# Altium schematic sheet 31.SchDoc
size 513 x 386 mm
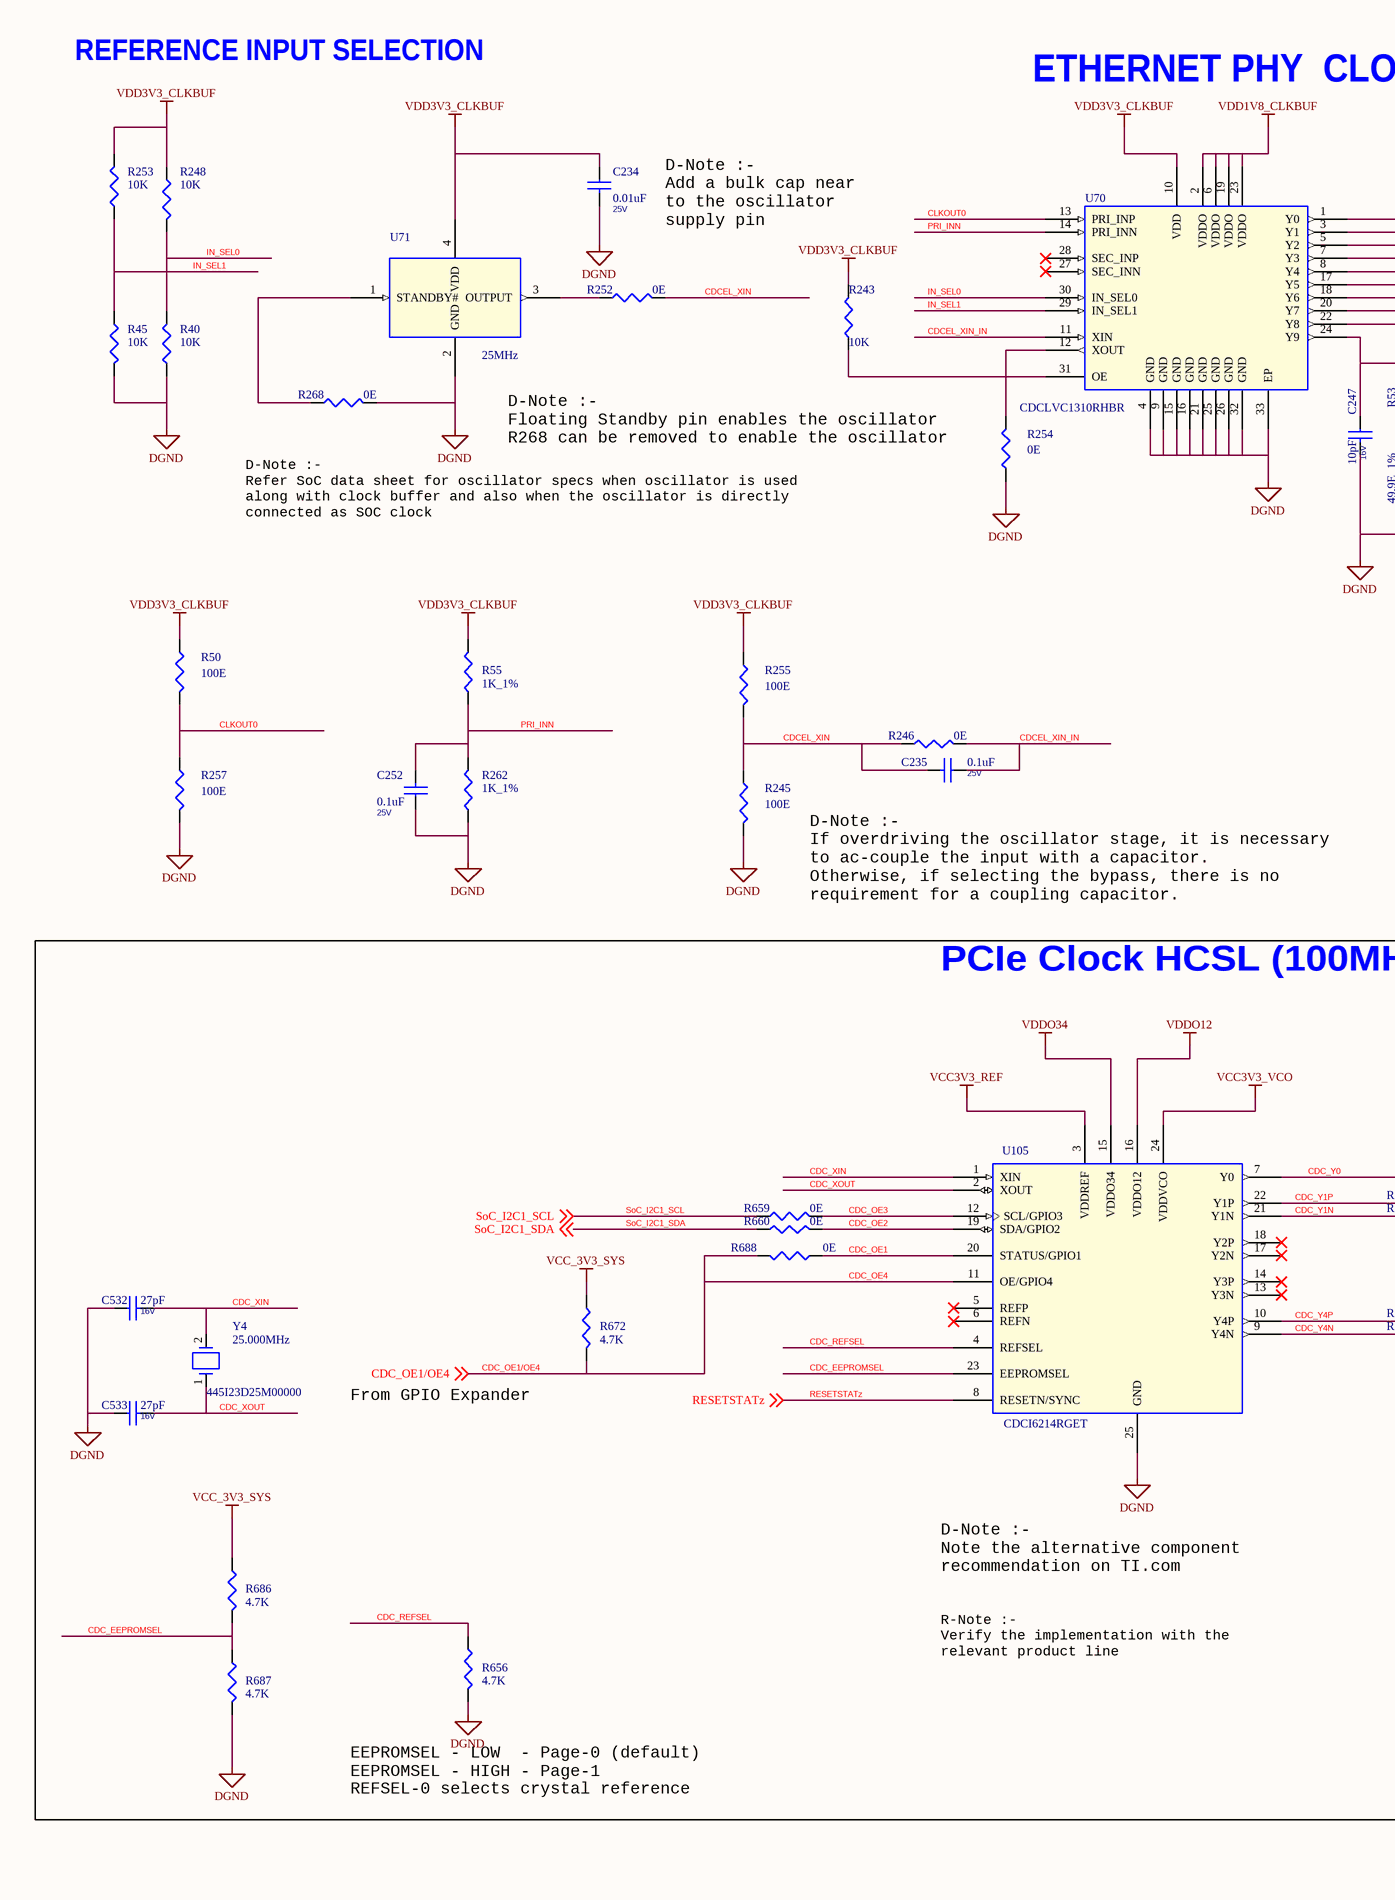
[diagram p0: 31.SchDoc, left]
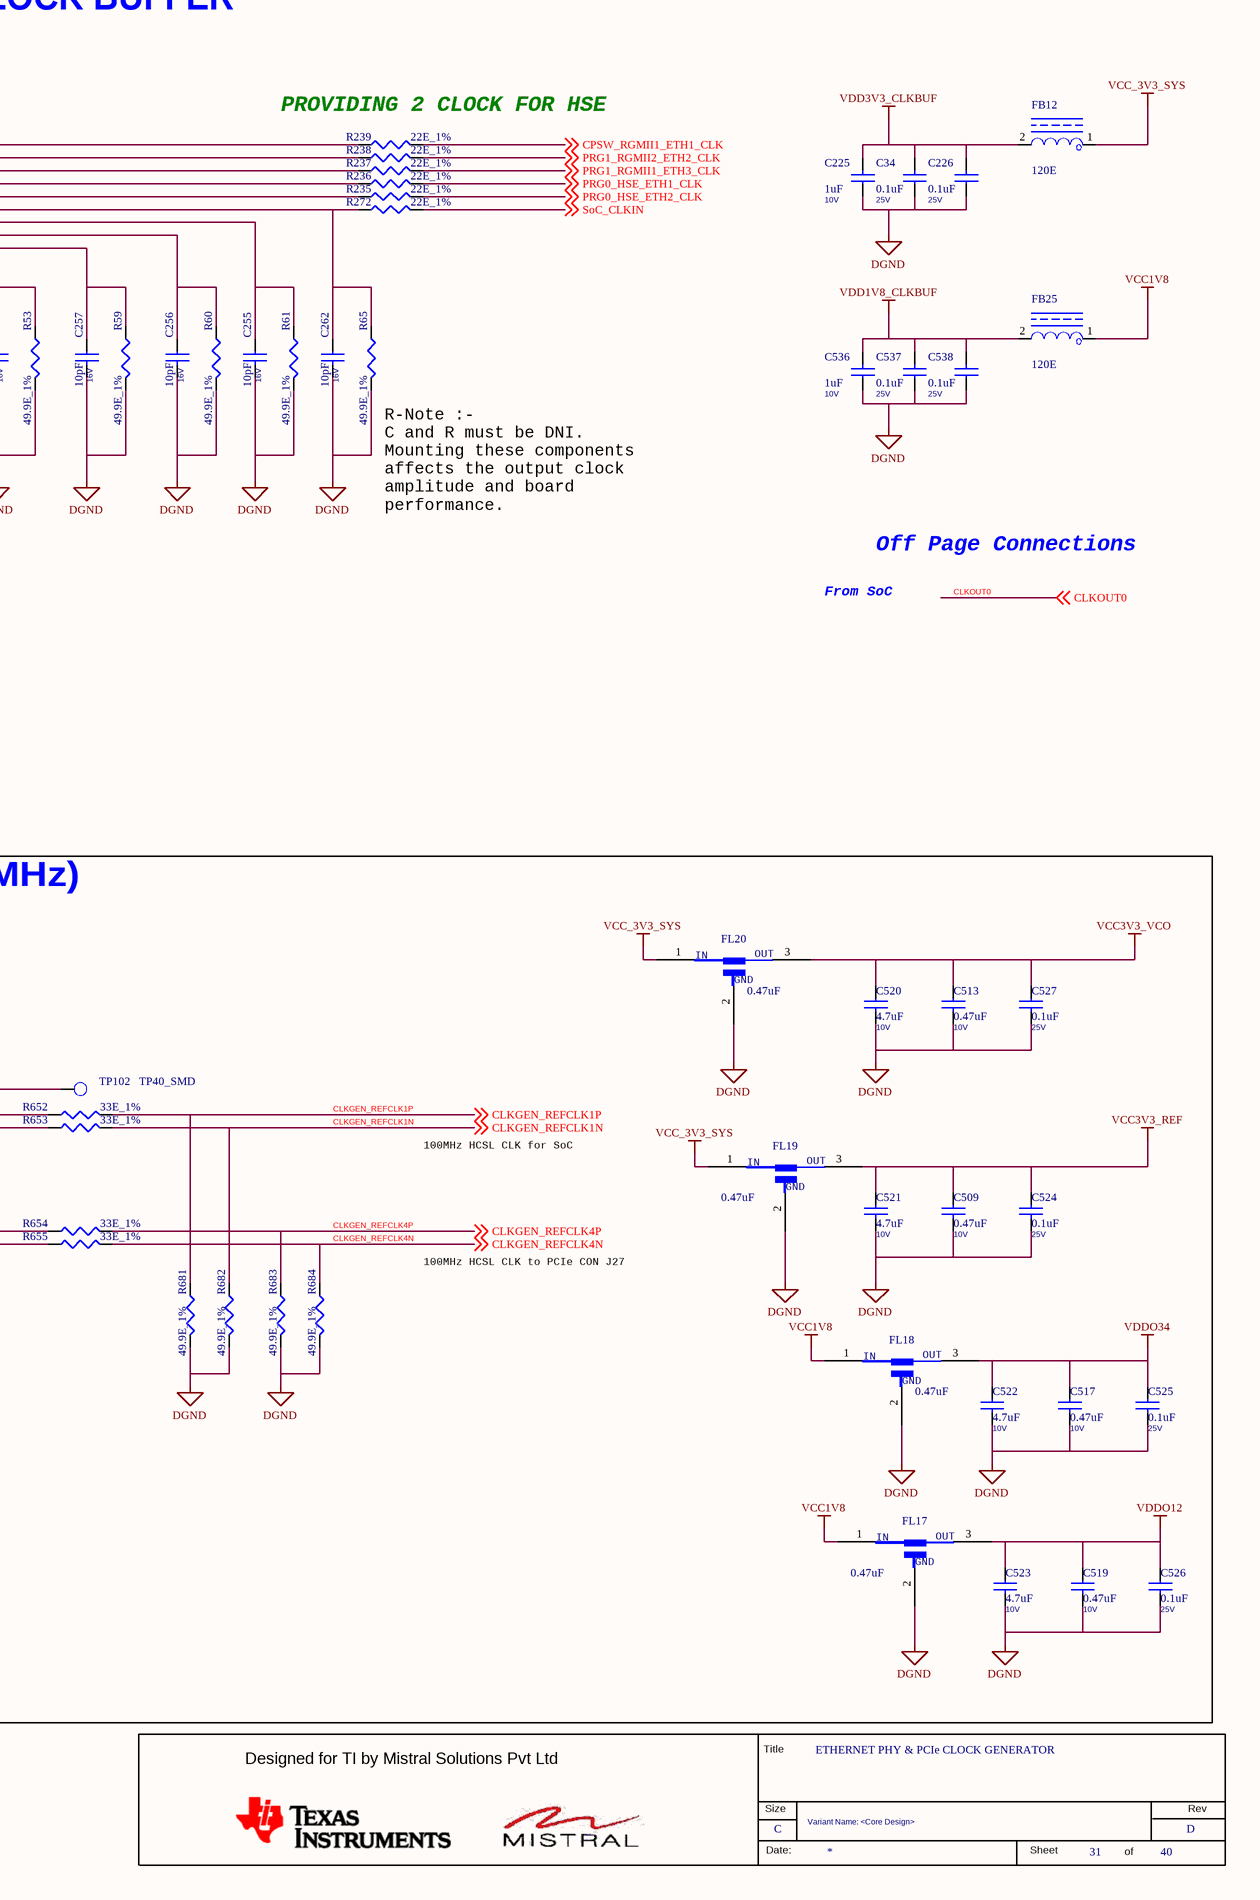
[diagram p1: 31.SchDoc, right]

## Parts
*  RevCode: D  Title: ETHERNET PHY & PCIe CLOCK GENERATOR  Page Size: C  Page Number: 31  Page Count: 40  Variant Name: <Core Design>  (hidden comment: MISTRAL_TITLEBLK_CSIZE)  (graphical)
C34  0.1uF  Voltage: 25V  [CAP0402_0-75]
C225  1uF  Voltage: 10V  [CAP0402_0-75]
C226  0.1uF  Voltage: 25V  [CAP0402_0-75]
C234  0.01uF  Voltage: 25V  [CAP0201_0-5]
C235  0.1uF  Voltage: 25V  [CAP0402_0-75]
C247  10pF  Voltage: 16V  [CAP0402_0-75]
C252  0.1uF  Voltage: 25V  [CAP0402_0-75]
C255  10pF  Voltage: 16V  [CAP0402_0-75]
C256  10pF  Voltage: 16V  [CAP0402_0-75]
C257  10pF  Voltage: 16V  [CAP0402_0-75]
C262  10pF  Voltage: 16V  [CAP0402_0-75]
C509  0.47uF  Voltage: 10V  [CAP0402_0-75]
C513  0.47uF  Voltage: 10V  [CAP0402_0-75]
C517  0.47uF  Voltage: 10V  [CAP0402_0-75]
C519  0.47uF  Voltage: 10V  [CAP0402_0-75]
C520  4.7uF  Voltage: 10V  [CAP0402_0-75]
C521  4.7uF  Voltage: 10V  [CAP0402_0-75]
C522  4.7uF  Voltage: 10V  [CAP0402_0-75]
C523  4.7uF  Voltage: 10V  [CAP0402_0-75]
C524  0.1uF  Voltage: 25V  [CAP0402_0-75]
C525  0.1uF  Voltage: 25V  [CAP0402_0-75]
C526  0.1uF  Voltage: 25V  [CAP0402_0-75]
C527  0.1uF  Voltage: 25V  [CAP0402_0-75]
C532  27pF  Voltage: 16V  [CAP0402_0-75]
C533  27pF  Voltage: 16V  [CAP0402_0-75]
C536  1uF  Voltage: 10V  [CAP0402_0-75]
C537  0.1uF  Voltage: 25V  [CAP0402_0-75]
C538  0.1uF  Voltage: 25V  [CAP0402_0-75]
FB12  120E  [IND0603_1]
FB25  120E  [IND0603_1]
FL17  0.47uF  [EMIFIL_NFM21P_0805]
FL18  0.47uF  [EMIFIL_NFM21P_0805]
FL19  0.47uF  [EMIFIL_NFM21P_0805]
FL20  0.47uF  [EMIFIL_NFM21P_0805]
R40  10K  [RES0402_0-5]
R45  10K  [RES0402_0-5]
R50  100E  [RES0402_0-5]
R53  49.9E_1%  [RES0402_0-5]
R55  1K_1%  [RES0402_0-5]
R59  49.9E_1%  [RES0402_0-5]
R60  49.9E_1%  [RES0402_0-5]
R61  49.9E_1%  [RES0402_0-5]
R65  49.9E_1%  [RES0402_0-5]
R235  22E_1%  [RES0402_0-5]
R236  22E_1%  [RES0402_0-5]
R237  22E_1%  [RES0402_0-5]
R238  22E_1%  [RES0402_0-5]
R239  22E_1%  [RES0402_0-5]
R243  10K  [RES0402_0-5]
R245  100E  [RES0402_0-5]
R246  0E  [RES0402_0-5]
R248  10K  [RES0402_0-5]
R252  0E  [RES0402_0-5]
R253  10K  [RES0402_0-5]
R254  0E  [RES0402_0-5]
R255  100E  [RES0402_0-5]
R257  100E  [RES0402_0-5]
R262  1K_1%  [RES0402_0-5]
R268  0E  [RES0402_0-5]
R272  22E_1%  [RES0402_0-5]
R652  33E_1%  [RES0402_0-5]
R653  33E_1%  [RES0402_0-5]
R654  33E_1%  [RES0402_0-5]
R655  33E_1%  [RES0402_0-5]
R656  4.7K  [RES0402_0-5]
R659  0E  [RES0402_0-5]
R660  0E  [RES0402_0-5]
R672  4.7K  [RES0402_0-5]
R681  49.9E_1%  [RES0402_0-5]
R682  49.9E_1%  [RES0402_0-5]
R683  49.9E_1%  [RES0402_0-5]
R684  49.9E_1%  [RES0402_0-5]
R686  4.7K  [RES0402_0-5]
R687  4.7K  [RES0402_0-5]
R688  0E  [RES0402_0-5]
TP102  TP40_SMD  [TP40_SMD]
U70  CDCLVC1310RHBR  [QFN32_19-68_200X200_1]
U71  25MHz  [OSC4_ASFLMB_200X130_SMD]
U105  CDCI6214RGET  [QFN24_19-68_160X160_1]
Y4  25.000MHz  Mfr_part_number: 445I23D25M00000  [XTAL_ABM3_205X130_SMD_1-4]

## Blocks framed on the sheet
PCIe Clock HCSL (100MHz): C509 C513 C517 C519-C527 C532 C533 FL17-FL20 R652-R656 R659 R660 R672 R681-R684 R686-R688 TP102 U105 Y4

## Nets
DGND: C34.1 C225.1 C226.1 C234.2 C247.2 C252.1 C255.2 C256.2 C257.2 C262.2 C509.2 C513.2 C517.2 C519.2 C520.2 C521.2 C522.2 C523.2 C524.2 C525.2 C526.2 C527.2 C532.1 C533.1 C536.1 C537.1 C538.1 FL17.2(GND1) FL18.2(GND1) FL19.2(GND1) FL20.2(GND1) R40.1 R45.2 R53.2 R59.2 R60.2 R61.2 R65.2 R245.2 R254.1 R257.2 R262.1 R268.2 R656.2 R681.2 R682.2 R683.2 R684.2 R687.2 U70.4(GND) U70.9(GND) U70.15(GND) U70.16(GND) U70.21(GND) U70.25(GND) U70.26(GND) U70.32(GND) U70.33(EP) U71.2(GND) U105.25(GND)
VCC1V8: FB25.1 FL17.1(IN) FL18.1(IN)
VCC3V3_REF: C509.1 C521.1 C524.1 FL19.3(OUT) U105.3(VDDREF)
VCC3V3_VCO: C513.1 C520.1 C527.1 FL20.3(OUT) U105.24(VDDVCO)
VCC_3V3_SYS: FB12.1 FL19.1(IN) FL20.1(IN) R672.1 R686.1
VDD1V8_CLKBUF: C536.2 C537.2 C538.2 FB25.2 U70.2(VDDO) U70.6(VDDO) U70.19(VDDO) U70.23(VDDO)
VDD3V3_CLKBUF: C34.2 C225.2 C226.2 C234.1 FB12.2 R50.1 R55.2 R243.2 R248.1 R253.2 R255.1 U70.10(VDD) U71.4(VDD)
VDDO12: C519.1 C523.1 C526.1 FL17.3(OUT) U105.16(VDDO12)
VDDO34: C517.1 C522.1 C525.1 FL18.3(OUT) U105.15(VDDO34)
CDC_EEPROMSEL: R686.2 R687.1 U105.23(EEPROMSEL)
CDC_OE1: R688.1 U105.20(STATUS/GPIO1)
CDC_OE1/OE4: R672.2 R688.2 U105.11(OE/GPIO4) ; off-sheet CDC_OE1/OE4  [also labelled CDC_OE4]
CDC_OE2: R660.2 U105.19(SDA/GPIO2)
CDC_OE3: R659.2 U105.12(SCL/GPIO3)
CDC_REFSEL: R656.1 U105.4(REFSEL)
CDC_XIN: C532.2 U105.1(XIN) Y4.2
CDC_XOUT: C533.2 U105.2(XOUT) Y4.1
CDC_Y0: TP102.1(TP) U105.7(Y0)
CDC_Y1N: R653.1 U105.21(Y1N)
CDC_Y1P: R652.1 U105.22(Y1P)
CDC_Y4N: R655.1 U105.9(Y4N)
CDC_Y4P: R654.1 U105.10(Y4P)
CDCEL_XIN: C235.2 R245.1 R246.1 R252.2 R255.2
CDCEL_XIN_IN: C235.1 R246.2 U70.11(XIN)
CLKGEN_REFCLK1N: R653.2 R682.1 ; off-sheet CLKGEN_REFCLK1N
CLKGEN_REFCLK1P: R652.2 R681.1 ; off-sheet CLKGEN_REFCLK1P
CLKGEN_REFCLK4N: R655.2 R684.1 ; off-sheet CLKGEN_REFCLK4N
CLKGEN_REFCLK4P: R654.2 R683.1 ; off-sheet CLKGEN_REFCLK4P
CLKOUT0: R50.2 R257.1 U70.13(PRI_INP) ; off-sheet CLKOUT0
CPSW_RGMII1_ETH1_CLK: R239.2 ; off-sheet CPSW_RGMII1_ETH1_CLK
IN_SEL0: R40.2 R248.2 U70.30(IN_SEL0)
IN_SEL1: R45.1 R253.1 U70.29(IN_SEL1)
PRG0_HSE_ETH1_CLK: R236.2 ; off-sheet PRG0_HSE_ETH1_CLK
PRG0_HSE_ETH2_CLK: R235.2 ; off-sheet PRG0_HSE_ETH2_CLK
PRG1_RGMII1_ETH3_CLK: R237.2 ; off-sheet PRG1_RGMII1_ETH3_CLK
PRG1_RGMII2_ETH2_CLK: R238.2 ; off-sheet PRG1_RGMII2_ETH2_CLK
PRI_INN: C252.2 R55.1 R262.2 U70.14(PRI_INN)
RESETSTATz: U105.8(RESETN/SYNC) ; off-sheet RESETSTATz
SoC_CLKIN: R272.2 ; off-sheet SoC_CLKIN
SoC_I2C1_SCL: R659.1 ; off-sheet SoC_I2C1_SCL
SoC_I2C1_SDA: R660.1 ; off-sheet SoC_I2C1_SDA
NetC247_1: C247.1 R53.1 U70.24(Y9)
NetC255_1: C255.1 R61.1 U70.18(Y6)
NetC256_1: C256.1 R60.1 U70.20(Y7)
NetC257_1: C257.1 R59.1 U70.22(Y8)
NetC262_1: C262.1 R65.1 R272.1 U70.17(Y5)
NetR235_1: R235.1 U70.8(Y4)
NetR236_1: R236.1 U70.7(Y3)
NetR237_1: R237.1 U70.5(Y2)
NetR238_1: R238.1 U70.3(Y1)
NetR239_1: R239.1 U70.1(Y0)
NetR243_1: R243.1 U70.31(OE)
NetR252_1: R252.1 U71.3(OUTPUT)
NetR254_2: R254.2 U70.12(XOUT)
NetR268_1: R268.1 U71.1(STANDBY#)

Not connected (* = marked no-connect by the designer): U70 27(SEC_INN)* 28(SEC_INP)*; U105 5(REFP)* 6(REFN)* 13(Y3N)* 14(Y3P)* 17(Y2N)* 18(Y2P)*

## Notes on the sheet
- REFERENCE INPUT SELECTION
- ETHERNET PHY  CLOCK BUFFER
- D-Note :-
  Add a bulk cap near
  to the oscillator
  supply pin
- PROVIDING 2 CLOCK FOR HSE
- (near R254) D-Note :-
  Floating Standby pin enables the oscillator
  R268 can be removed to enable the oscillator
- D-Note :-
  Refer SoC data sheet for oscillator specs when oscillator is used
  along with clock buffer and also when the oscillator is directly
  connected as SOC clock
- (near R65) R-Note :-
  C and R must be DNI.
  Mounting these components
  affects the output clock
  amplitude and board
  performance.
- Off Page Connections
- From SoC
- (near C235) D-Note :-
  If overdriving the oscillator stage, it is necessary
  to ac-couple the input with a capacitor.
  Otherwise, if selecting the bypass, there is no
  requirement for a coupling capacitor.
- 100MHz HCSL CLK for SoC
- 100MHz HCSL CLK to PCIe CON J27
- From GPIO Expander
- D-Note :-
  Note the alternative component
  recommendation on TI.com
- R-Note :-
  Verify the implementation with the
  relevant product line
- EEPROMSEL - LOW  - Page-0 (default)
  EEPROMSEL - HIGH - Page-1
- REFSEL-0 selects crystal reference
- (in symbol CAP_FILTER) GND
- (in symbol MISTRAL_TITLEBLK_CSIZE) Title; Designed for TI by Mistral Solutions Pvt Ltd; Size; Rev; Date:; Sheet; of

## Library data of the parts
* = MISTRAL_TITLEBLK_CSIZE: Issue: 1.0; Page Create Date: March  8, 1995; Page Modify Date: *
C34 C226 C235 C524 = CAP_Dup3: CAP CERAMIC 0.1uF 25V 20% X5R 0402; Alt_Mfr_name: YAGEO AMERICA; Part_type: CAPACITORS\CERAMIC; Mfr_part_number: 885012105018; Mfr_name: WURTH ELECTRONICS; Mistral Part No: 120020080003-R; Alt_Mfr_part_number: CC0402KRX5R8BB104; Custom_Duty: 15%; Customs_HS_Code: 85322990; Wattage: NA; Project: AM64x_EVM_BRD; PCB Footprint: CAP0402_0-75; Footprint Path: Y:\MIS_DATABASE\Library\ALTIUM_TOOL\PCB_FOOTPRINTS\Altium_Footprint_Lib.PcbLib; Library Path: Y:\MIS_DATABASE\Library\ALTIUM_TOOL\SCHEMATICS_PARTS\MS_DISCRETE_Library.schlib; Footprint Ref: CAP0402_0-75; Library Ref: CAP; MECHANICAL 3D STEP FILE: CAP0402_0-75; Chkd/date: MANIRAJA/170820; Crtd /date: ALVY/170820; Datasheet: Y:\MIS_DATABASE\DATASHEETS\CAPACITORS\885012105018.PDF; Temperature: -55癈+85癈; Weight: 0.65mg; Height: 0.55MM; Distributor_part_number: 732-7495-1-ND; Distributor_name: DIGIKEY; Package: 0402; Tolerance: 20%
C225 = CAP_Dup3: CAP CERAMIC 1uF 10V 20% X5R 0402; Part_type: CAPACITORS\CERAMIC; Mfr_part_number: 885012105012; Mfr_name: WURTH ELECTRONICS; Mistral Part No: 120020080009-R; Custom_Duty: 15%; Customs_HS_Code: 85322990; Wattage: NA; Project: AM64x_EVM_BRD; PCB Footprint: CAP0402_0-75; Footprint Path: Y:\MIS_DATABASE\Library\ALTIUM_TOOL\PCB_FOOTPRINTS\Altium_Footprint_Lib.PcbLib; Library Path: Y:\MIS_DATABASE\Library\ALTIUM_TOOL\SCHEMATICS_PARTS\MS_DISCRETE_Library.schlib; MECHANICAL 3D STEP FILE: CAP0402_0-75; Chkd/date: MANIRAJA/210820; Crtd /date: ALVY/190820; Datasheet: Y:\MIS_DATABASE\DATASHEETS\CAPACITORS\885012105012.PDF; Temperature: -55癈+85癈; Weight: 0.65mg; Height: 0.55MM; Distributor_part_number: 732-7489-1-ND; Distributor_name: DIGIKEY; Package: 0402; Tolerance: 20%; Library Ref: CAP; Footprint Ref: CAP0402_0-75
C234 = CAP_Dup3: CAP CERAMIC 0.01uF 25V 10% X5R 0201; Part_type: CAPACITORS\CERAMIC; Mfr_part_number: GRM033R61E103KA12J; Mfr_name: MURATA; Mistral Part No: 120018010007-R; Custom_Duty: 15%; Customs_HS_Code: 85322990; Project: TI_MAXIE_CPB; Wattage: NA; PCB Footprint: CAP0201_0-5; Library Ref: CAP; Chkd/date: MANIRAJA/230118; Crtd /date: MANIRAJA/230118; Datasheet: Y:\MIS_DATABASE\DATASHEETS\CAPACITORS\GRM033R61E103KA12.PDF; Height: 0.33MM; Distributor_part_number: GRM033R61E103KA12J-ND; Distributor_name: DIGIKEY; Package: 0201; Tolerance: 10%; Weight: 0.33mg; Temperature: -55癈+85癈; MECHANICAL 3D STEP FILE: CAP0201_0-5; Footprint Ref: CAP0201_0-5; Library Path: Y:\MIS_DATABASE\Library\ALTIUM_TOOL\SCHEMATICS_PARTS\MS_DISCRETE_Library.schlib; Footprint Path: Y:\MIS_DATABASE\Library\ALTIUM_TOOL\PCB_FOOTPRINTS\Altium_Footprint_Lib.PcbLib
C247 C255-C257 C262 = CAP_Dup3: CAP CERAMIC 10pF 16V 5% C0G(NP0) 0402; Mistral Part No: 120018030015-R; Mfr_name: WURTH ELECTRONICS; Mfr_part_number: 885012005025; Part_type: CAPACITORS\CERAMIC; Project: SMART-M_SCRIPTALK_PB; Wattage: NA; Customs_HS_Code: 85322990; Custom_Duty: 15%; PCB Footprint: CAP0402_0-75; Footprint Ref: CAP0402_0-75; Tolerance: 5%; Package: 0402; Distributor_name: DIGIKEY; Distributor_part_number: 732-7441-1-ND; Library Ref: CAP; Height: 0.55MM; Weight: 0.65mg; Temperature: -55癈+125癈; Datasheet: Y:\MIS_DATABASE\DATASHEETS\CAPACITORS\885012005025.PDF; Crtd /date: ALVY/100918; Chkd/date: MANIRAJA/100918; MECHANICAL 3D STEP FILE: CAP0402_0-75; Library Path: Y:\MIS_DATABASE\Library\ALTIUM_TOOL\SCHEMATICS_PARTS\MS_DISCRETE_Library.schlib; Footprint Path: Y:\MIS_DATABASE\Library\ALTIUM_TOOL\PCB_FOOTPRINTS\Altium_Footprint_Lib.PcbLib
C252 C525-C527 C537 C538 = CAP_Dup3: CAP CERAMIC 0.1uF 25V 20% X5R 0402; Alt_Mfr_part_number: CC0402KRX5R8BB104; Mistral Part No: 120020080003-R; Mfr_name: WURTH ELECTRONICS; Mfr_part_number: 885012105018; Part_type: CAPACITORS\CERAMIC; Alt_Mfr_name: YAGEO AMERICA; Project: AM64x_EVM_BRD; Wattage: NA; Customs_HS_Code: 85322990; Custom_Duty: 15%; Tolerance: 20%; Package: 0402; Distributor_name: DIGIKEY; Distributor_part_number: 732-7495-1-ND; Height: 0.55MM; Weight: 0.65mg; Temperature: -55癈+85癈; Datasheet: Y:\MIS_DATABASE\DATASHEETS\CAPACITORS\885012105018.PDF; Crtd /date: ALVY/170820; Chkd/date: MANIRAJA/170820; MECHANICAL 3D STEP FILE: CAP0402_0-75; Library Ref: CAP; Footprint Ref: CAP0402_0-75; Library Path: Y:\MIS_DATABASE\Library\ALTIUM_TOOL\SCHEMATICS_PARTS\MS_DISCRETE_Library.schlib; Footprint Path: Y:\MIS_DATABASE\Library\ALTIUM_TOOL\PCB_FOOTPRINTS\Altium_Footprint_Lib.PcbLib; PCB Footprint: CAP0402_0-75
C509 = CAP_Dup3: CAP CERAMIC 0.47uF 10V 10% X7S AUTO 0402; Part_type: CAPACITORS\CERAMIC; Mfr_part_number: CGA2B3X7S1A474K050BB; Mfr_name: TDK CORPORATION; Mistral Part No: 120018090057-R; Custom_Duty: 15%; Customs_HS_Code: 85322990; Wattage: NA; Project: TI_MAXIE_CPB; PCB Footprint: CAP0402_0-75; Library Ref: CAP; MECHANICAL 3D STEP FILE: CAP0402_0-75; Chkd/date: MANIRAJA/190220; Crtd /date: ALVY/190220; Datasheet: Y:\MIS_DATABASE\DATASHEETS\CAPACITORS\CGA2B3X7S1A474K050BB.PDF; Temperature: -55癈+125癈; Weight: 0.65mg; Height: 0.55MM; Distributor_part_number: 445-16100-1-ND; Distributor_name: DIGIKEY; Package: 0402; Tolerance: 10%; Footprint Ref: CAP0402_0-75; Library Path: Y:\MIS_DATABASE\Library\ALTIUM_TOOL\SCHEMATICS_PARTS\MS_DISCRETE_Library.schlib; Footprint Path: Y:\MIS_DATABASE\Library\ALTIUM_TOOL\PCB_FOOTPRINTS\Altium_Footprint_Lib.PcbLib
C513 C517 C519 = CAP_Dup3: CAP CERAMIC 0.47uF 10V 10% X7S AUTO 0402; Mistral Part No: 120018090057-R; Mfr_name: TDK CORPORATION; Mfr_part_number: CGA2B3X7S1A474K050BB; Part_type: CAPACITORS\CERAMIC; Project: TI_MAXIE_CPB; Wattage: NA; Customs_HS_Code: 85322990; Custom_Duty: 15%; PCB Footprint: CAP0402_0-75; Library Ref: CAP; MECHANICAL 3D STEP FILE: CAP0402_0-75; Tolerance: 10%; Package: 0402; Distributor_name: DIGIKEY; Distributor_part_number: 445-16100-1-ND; Height: 0.55MM; Weight: 0.65mg; Temperature: -55癈+125癈; Datasheet: Y:\MIS_DATABASE\DATASHEETS\CAPACITORS\CGA2B3X7S1A474K050BB.PDF; Crtd /date: ALVY/190220; Chkd/date: MANIRAJA/190220; Footprint Ref: CAP0402_0-75; Library Path: Y:\MIS_DATABASE\Library\ALTIUM_TOOL\SCHEMATICS_PARTS\MS_DISCRETE_Library.schlib; Footprint Path: Y:\MIS_DATABASE\Library\ALTIUM_TOOL\PCB_FOOTPRINTS\Altium_Footprint_Lib.PcbLib
C520 C521 C523 = CAP_Dup3: CAP CERAMIC 4.7uF 10V 20% X5R 0402; Part_type: CAPACITORS\CERAMIC; Mfr_part_number: 0402ZD475MAT2A; Mfr_name: AVX CORPORATION; Mistral Part No: 120012060002-R; Custom_Duty: 15%; Customs_HS_Code: 85322990; Wattage: NA; Project: TI_MAXIE_CPB; PCB Footprint: CAP0402_0-75; Library Ref: CAP; MECHANICAL 3D STEP FILE: CAP0402_0-75; Chkd/date: MANIRAJA/230118; Crtd /date: MANIRAJA/230118; Datasheet: Y:\MIS_DATABASE\DATASHEETS\CAPACITORS\AVX_MLC.PDF; Temperature: -55癈+85癈; Weight: 0.65mg; Height: 0.71MM; Distributor_part_number: 478-10791-1-ND; Distributor_name: DIGIKEY; Package: 0402; Tolerance: 20%; Footprint Ref: CAP0402_0-75; Library Path: Y:\MIS_DATABASE\Library\ALTIUM_TOOL\SCHEMATICS_PARTS\MS_DISCRETE_Library.schlib; Footprint Path: Y:\MIS_DATABASE\Library\ALTIUM_TOOL\PCB_FOOTPRINTS\Altium_Footprint_Lib.PcbLib
C522 = CAP_Dup3: CAP CERAMIC 4.7uF 10V 20% X5R 0402; Mistral Part No: 120012060002-R; Mfr_name: AVX CORPORATION; Mfr_part_number: 0402ZD475MAT2A; Part_type: CAPACITORS\CERAMIC; Project: TI_MAXIE_CPB; Wattage: NA; Customs_HS_Code: 85322990; Custom_Duty: 15%; PCB Footprint: CAP0402_0-75; Footprint Path: Y:\MIS_DATABASE\Library\ALTIUM_TOOL\PCB_FOOTPRINTS\Altium_Footprint_Lib.PcbLib; Library Path: Y:\MIS_DATABASE\Library\ALTIUM_TOOL\SCHEMATICS_PARTS\MS_DISCRETE_Library.schlib; Footprint Ref: CAP0402_0-75; Tolerance: 20%; Package: 0402; Distributor_name: DIGIKEY; Distributor_part_number: 478-10791-1-ND; Height: 0.71MM; Weight: 0.65mg; Temperature: -55癈+85癈; Datasheet: Y:\MIS_DATABASE\DATASHEETS\CAPACITORS\AVX_MLC.PDF; Crtd /date: MANIRAJA/230118; Chkd/date: MANIRAJA/230118; MECHANICAL 3D STEP FILE: CAP0402_0-75; Library Ref: CAP
C532 = CAP_Dup3: CAP CERAMIC 27pF 16V 5% C0G(NP0) 0402; Mistral Part No: 120021020020-R; Mfr_name: AVX CORPORATION; Mfr_part_number: 0402YA270JAT2A; Part_type: CAPACITORS\CERAMIC; Project: TI_AM64x_EVM; Wattage: NA; Customs_HS_Code: 85322990; Custom_Duty: 15%; PCB Footprint: CAP0402_0-75; Tolerance: 5%; Package: 0402; Distributor_name: DIGIKEY; Distributor_part_number: 478-0402YA270JAT2ACT-ND; Library Ref: CAP; Footprint Ref: CAP0402_0-75; Height: 0.56MM; Weight: 1.5mg; Temperature: -55癈+125癈; Datasheet: Y:\MIS_DATABASE\DATASHEETS\CAPACITORS\AVX_MLC.PDF; Crtd /date: MANIRAJA/100221; Chkd/date: ALVY/100221; MECHANICAL 3D STEP FILE: CAP0402_0-75; Library Path: Y:\MIS_DATABASE\Library\ALTIUM_TOOL\SCHEMATICS_PARTS\MS_DISCRETE_Library.schlib; Footprint Path: Y:\MIS_DATABASE\Library\ALTIUM_TOOL\PCB_FOOTPRINTS\Altium_Footprint_Lib.PcbLib
C533 = CAP_Dup3: CAP CERAMIC 27pF 16V 5% C0G(NP0) 0402; Part_type: CAPACITORS\CERAMIC; Mfr_part_number: 0402YA270JAT2A; Mfr_name: AVX CORPORATION; Mistral Part No: 120021020020-R; Custom_Duty: 15%; Customs_HS_Code: 85322990; Wattage: NA; Project: TI_AM64x_EVM; PCB Footprint: CAP0402_0-75; Footprint Path: Y:\MIS_DATABASE\Library\ALTIUM_TOOL\PCB_FOOTPRINTS\Altium_Footprint_Lib.PcbLib; Library Path: Y:\MIS_DATABASE\Library\ALTIUM_TOOL\SCHEMATICS_PARTS\MS_DISCRETE_Library.schlib; MECHANICAL 3D STEP FILE: CAP0402_0-75; Chkd/date: ALVY/100221; Crtd /date: MANIRAJA/100221; Datasheet: Y:\MIS_DATABASE\DATASHEETS\CAPACITORS\AVX_MLC.PDF; Temperature: -55癈+125癈; Weight: 1.5mg; Height: 0.56MM; Footprint Ref: CAP0402_0-75; Library Ref: CAP; Distributor_part_number: 478-0402YA270JAT2ACT-ND; Distributor_name: DIGIKEY; Package: 0402; Tolerance: 5%
C536 = CAP_Dup3: CAP CERAMIC 1uF 10V 20% X5R 0402; Mistral Part No: 120020080009-R; Mfr_name: WURTH ELECTRONICS; Mfr_part_number: 885012105012; Part_type: CAPACITORS\CERAMIC; Project: AM64x_EVM_BRD; Wattage: NA; Customs_HS_Code: 85322990; Custom_Duty: 15%; PCB Footprint: CAP0402_0-75; Footprint Ref: CAP0402_0-75; Library Ref: CAP; Tolerance: 20%; Package: 0402; Distributor_name: DIGIKEY; Distributor_part_number: 732-7489-1-ND; Height: 0.55MM; Weight: 0.65mg; Temperature: -55癈+85癈; Datasheet: Y:\MIS_DATABASE\DATASHEETS\CAPACITORS\885012105012.PDF; Crtd /date: ALVY/190820; Chkd/date: MANIRAJA/210820; MECHANICAL 3D STEP FILE: CAP0402_0-75; Library Path: Y:\MIS_DATABASE\Library\ALTIUM_TOOL\SCHEMATICS_PARTS\MS_DISCRETE_Library.schlib; Footprint Path: Y:\MIS_DATABASE\Library\ALTIUM_TOOL\PCB_FOOTPRINTS\Altium_Footprint_Lib.PcbLib
FB12 = INDUCTOR_FERRITE: IND FERRITE BEAD CHIP 120E 2A 0603; Mistral Part No: 130020080015-R; Mfr_name: WURTH ELECTRONICS; Mfr_part_number: 782631141; Project: AM64x_EVM_BRD; Tolerance: 25%; Voltage: NA; Customs_HS_Code: 85437099; Custom_Duty: 24%; PCB Footprint: IND0603_1; Footprint Ref: IND0603_1; Part_type: INDUCTOR; Wattage: NA; Package: 0603; Distributor_name: DIGIKEY; Distributor_part_number: 732-782631141CT-ND; Library Ref: INDUCTOR_FERRITE; Height: 1.00MM; Weight: NA; Temperature: -55癈+125癈; Datasheet: Y:\MIS_DATABASE\DATASHEETS\DISCRETES\INDUCTORS\782631141.PDF; Crtd /date: ALVY/180820; Chkd/date: MANIRAJA/180820; MECHANICAL 3D STEP FILE: IND0603_1; Library Path: Y:\MIS_DATABASE\Library\ALTIUM_TOOL\SCHEMATICS_PARTS\MS_FILTER_Library.schlib; Footprint Path: Y:\MIS_DATABASE\Library\ALTIUM_TOOL\PCB_FOOTPRINTS\Altium_Footprint_Lib.PcbLib
FB25 = INDUCTOR_FERRITE: IND FERRITE BEAD CHIP 120E 2A 0603; Mfr_part_number: 782631141; Mfr_name: WURTH ELECTRONICS; Mistral Part No: 130020080015-R; Custom_Duty: 24%; Customs_HS_Code: 85437099; Wattage: NA; Tolerance: 25%; Project: AM64x_EVM_BRD; Footprint Path: Y:\MIS_DATABASE\Library\ALTIUM_TOOL\PCB_FOOTPRINTS\Altium_Footprint_Lib.PcbLib; Library Path: Y:\MIS_DATABASE\Library\ALTIUM_TOOL\SCHEMATICS_PARTS\MS_FILTER_Library.schlib; MECHANICAL 3D STEP FILE: IND0603_1; Chkd/date: MANIRAJA/180820; Crtd /date: ALVY/180820; Datasheet: Y:\MIS_DATABASE\DATASHEETS\DISCRETES\INDUCTORS\782631141.PDF; Temperature: -55癈+125癈; Weight: NA; Height: 1.00MM; Library Ref: INDUCTOR_FERRITE; Distributor_part_number: 732-782631141CT-ND; Distributor_name: DIGIKEY; Package: 0603; Voltage: NA; Part_type: INDUCTOR; Footprint Ref: IND0603_1; PCB Footprint: IND0603_1
FL17 FL19 = CAP_FILTER: PASSIVE FILTER EMI 0.47uF 0805; Mistral Part No: 130010010009; Mfr_name: MURATA; Mfr_part_number: NFM21PC474R1C3D; Part_type: MISC\FILTER; Project: KOPIN_MODULS; Customs_HS_Code: 85437099; Custom_Duty: 24%; PCB Footprint: EMIFIL_NFM21P_0805; Library Ref: CAP_FILTER; Package: 0805; Distributor_name: DIGIKEY; Distributor_part_number: 490-2537-1-ND; Height: 0.95MM; Weight: NA; Temperature: -55癈+125癈; Datasheet: Y:\MIS_DATABASE\DATASHEETS\ICS\MISC\NFM21P.PDF; Crtd /date: MUDDU/010210; Chkd/date: RAGESH/121010
FL18 FL20 = CAP_FILTER: PASSIVE FILTER EMI 0.47uF 0805; Part_type: MISC\FILTER; Mfr_part_number: NFM21PC474R1C3D; Mfr_name: MURATA; Mistral Part No: 130010010009; Custom_Duty: 24%; Customs_HS_Code: 85437099; Project: KOPIN_MODULS; PCB Footprint: EMIFIL_NFM21P_0805; Chkd/date: RAGESH/121010; Crtd /date: MUDDU/010210; Datasheet: Y:\MIS_DATABASE\DATASHEETS\ICS\MISC\NFM21P.PDF; Temperature: -55癈+125癈; Weight: NA; Height: 0.95MM; Distributor_part_number: 490-2537-1-ND; Distributor_name: DIGIKEY; Package: 0805; Library Ref: CAP_FILTER
R40 R45 R243 = RESISTOR_Dup6: RES 10K 1/16W 5% 0402; Part_type: RESISTORS\FIXED; Mfr_part_number: RC0402JR-0710KL; Mfr_name: YAGEO AMERICA; Mistral Part No: 110011060021-R; Custom_Duty: 15%; Customs_HS_Code: 85332119; Voltage: NA; Project: HSE; PCB Footprint: RES0402_0-5; Footprint Path: Y:\MIS_DATABASE\Library\ALTIUM_TOOL\PCB_FOOTPRINTS\Altium_Footprint_Lib.PcbLib; Library Path: Y:\MIS_DATABASE\Library\ALTIUM_TOOL\SCHEMATICS_PARTS\MS_DISCRETE_Library.schlib; Footprint Ref: RES0402_0-5; Library Ref: RESISTOR; MECHANICAL 3D STEP FILE: RES0402_0-5; Chkd/date: VASANTHA/061216; Crtd /date: MAZHAR/230805; Datasheet: Y:\MIS_DATABASE\DATASHEETS\RESISTORS\RCXXXXL-SER_MAR18.PDF; Temperature: -55癈+155癈; Weight: 0.65mg; Height: 0.40MM; Distributor_part_number: 311-10KJRCT-ND; Distributor_name: DIGIKEY; Package: 0402; Wattage: 1/16W; Tolerance: 5%
R50 R257 = RESISTOR_Dup6: RES 100E 1/16W 5% 0402; Mistral Part No: 110014060039-R; Mfr_name: VISHAY; Mfr_part_number: CRCW0402100RJNED; Part_type: RESISTORS\FIXED; Project: TI_MAXIE_CPB; Voltage: NA; Customs_HS_Code: 85332119; Custom_Duty: 15%; Footprint Path: Y:\MIS_DATABASE\Library\ALTIUM_TOOL\PCB_FOOTPRINTS\Altium_Footprint_Lib.PcbLib; Library Path: Y:\MIS_DATABASE\Library\ALTIUM_TOOL\SCHEMATICS_PARTS\MS_DISCRETE_Library.schlib; Footprint Ref: RES0402_0-5; Library Ref: RESISTOR; Tolerance: 5%; Wattage: 1/16W; Package: 0402; Distributor_name: DIGIKEY; Distributor_part_number: 541-100JCT-ND; Height: 0.40MM; Weight: 0.65mg; Temperature: -55癈+155癈; Datasheet: Y:\MIS_DATABASE\DATASHEETS\RESISTORS\CRCW0603.PDF; Crtd /date: MANIRAJA/230817; Chkd/date: MANIRAJA/230817; MECHANICAL 3D STEP FILE: RES0402_0-5; PCB Footprint: RES0402_0-5
R53 R59-R61 R65 = RESISTOR: RES 49.9E 1/16W 1% 0402; Part_type: RESISTORS\FIXED; Mfr_part_number: CRCW040249R9FKEDC; Mfr_name: VISHAY; Mistral Part No: 110009030846-R; Custom_Duty: 15%; Customs_HS_Code: 85332119; Voltage: NA; Project: RFSU_RFTJ_CARD; PCB Footprint: RES0402_0-5; Footprint Path: Y:\MIS_DATABASE\Library\ALTIUM_TOOL\PCB_FOOTPRINTS\Altium_Footprint_Lib.PcbLib; Library Path: Y:\MIS_DATABASE\Library\ALTIUM_TOOL\SCHEMATICS_PARTS\MS_DISCRETE_Library.schlib; MECHANICAL 3D STEP FILE: RES0402_0-5; Chkd/date: MANIRAJA/210519; Crtd /date: MANIRAJA/210519; Datasheet: Y:\MIS_DATABASE\DATASHEETS\RESISTORS\CRCW_C-SER.PDF; Temperature: -55癈+155癈; Weight: 0.65mg; Height: 0.35MM; Library Ref: RESISTOR; Distributor_part_number: 541-3967-1-ND; Distributor_name: DIGIKEY; Package: 0402; Wattage: 1/16W; Tolerance: 1%; Footprint Ref: RES0402_0-5
R55 = RESISTOR_Dup5: RES 1K 1/10W 1% 0402; Part_type: RESISTORS\FIXED; Mfr_part_number: ERJ-2RKF1001X; Mfr_name: PANASONIC-ECG; Mistral Part No: 110009030411-R; Custom_Duty: 15%; Customs_HS_Code: 85332119; Voltage: NA; Project: VOCERA; Chkd/date: VASANTHA/281216; Crtd /date: MAZHAR/150506; Datasheet: Y:\MIS_DATABASE\DATASHEETS\RESISTORS\PAN-ERJSER_NOV17.PDF; Temperature: -55癈+155癈; Weight: 0.8mg; Height: 0.40MM; Distributor_part_number: P1.00KLCT-ND; Distributor_name: DIGIKEY; Package: 0402; Wattage: 1/10W; Tolerance: 1%; Library Ref: RESISTOR; Footprint Ref: RES0402_0-5; MECHANICAL 3D STEP FILE: RES0402_0-5; Library Path: Y:\MIS_DATABASE\Library\ALTIUM_TOOL\SCHEMATICS_PARTS\MS_DISCRETE_Library.schlib; Footprint Path: Y:\MIS_DATABASE\Library\ALTIUM_TOOL\PCB_FOOTPRINTS\Altium_Footprint_Lib.PcbLib; PCB Footprint: RES0402_0-5
R235 R237 R239 R272 = RESISTOR_Dup5: RES 22E 1/16W 1% 0402; Mistral Part No: 110009090004-R; Mfr_name: YAGEO AMERICA; Mfr_part_number: RC0402FR-0722RL; Part_type: RESISTORS\FIXED; Cust_part_number: 4700-80047E; SIGNAL_MODEL: RESISTOR_RES0402_22E_22E; Project: VMEFMCD; Voltage: NA; Customs_HS_Code: 85332119; Custom_Duty: 15%; Tolerance: 1%; Wattage: 1/16W; Package: 0402; Distributor_name: DIGIKEY; Distributor_part_number: 311-22.0LRCT-ND; Height: 0.40MM; Weight: 0.65mg; Temperature: -55癈+155癈; Datasheet: Y:\MIS_DATABASE\DATASHEETS\RESISTORS\RCXXXXL-SER_MAR18.PDF; Crtd /date: MAZHAR/090909; Chkd/date: SUHAS/290910; Library Ref: RESISTOR; Footprint Ref: RES0402_0-5; MECHANICAL 3D STEP FILE: RES0402_0-5; Library Path: Y:\MIS_DATABASE\Library\ALTIUM_TOOL\SCHEMATICS_PARTS\MS_DISCRETE_Library.schlib; Footprint Path: Y:\MIS_DATABASE\Library\ALTIUM_TOOL\PCB_FOOTPRINTS\Altium_Footprint_Lib.PcbLib; PCB Footprint: RES0402_0-5
R236 R238 = RESISTOR_Dup5: RES 22E 1/16W 1% 0402; Cust_part_number: 4700-80047E; Part_type: RESISTORS\FIXED; Mfr_part_number: RC0402FR-0722RL; Mfr_name: YAGEO AMERICA; Mistral Part No: 110009090004-R; Custom_Duty: 15%; Customs_HS_Code: 85332119; Voltage: NA; Project: VMEFMCD; SIGNAL_MODEL: RESISTOR_RES0402_22E_22E; Chkd/date: SUHAS/290910; Crtd /date: MAZHAR/090909; Datasheet: Y:\MIS_DATABASE\DATASHEETS\RESISTORS\RCXXXXL-SER_MAR18.PDF; Temperature: -55癈+155癈; Weight: 0.65mg; Height: 0.40MM; Distributor_part_number: 311-22.0LRCT-ND; Distributor_name: DIGIKEY; Package: 0402; Wattage: 1/16W; Tolerance: 1%; Library Ref: RESISTOR; Footprint Ref: RES0402_0-5; MECHANICAL 3D STEP FILE: RES0402_0-5; Library Path: Y:\MIS_DATABASE\Library\ALTIUM_TOOL\SCHEMATICS_PARTS\MS_DISCRETE_Library.schlib; Footprint Path: Y:\MIS_DATABASE\Library\ALTIUM_TOOL\PCB_FOOTPRINTS\Altium_Footprint_Lib.PcbLib; PCB Footprint: RES0402_0-5
R245 R255 = RESISTOR_Dup6: RES 100E 1/16W 5% 0402; Part_type: RESISTORS\FIXED; Mfr_part_number: CRCW0402100RJNED; Mfr_name: VISHAY; Mistral Part No: 110014060039-R; Custom_Duty: 15%; Customs_HS_Code: 85332119; Voltage: NA; Project: TI_MAXIE_CPB; Footprint Path: Y:\MIS_DATABASE\Library\ALTIUM_TOOL\PCB_FOOTPRINTS\Altium_Footprint_Lib.PcbLib; Library Path: Y:\MIS_DATABASE\Library\ALTIUM_TOOL\SCHEMATICS_PARTS\MS_DISCRETE_Library.schlib; Footprint Ref: RES0402_0-5; MECHANICAL 3D STEP FILE: RES0402_0-5; Chkd/date: MANIRAJA/230817; Crtd /date: MANIRAJA/230817; Datasheet: Y:\MIS_DATABASE\DATASHEETS\RESISTORS\CRCW0603.PDF; Temperature: -55癈+155癈; Weight: 0.65mg; Height: 0.40MM; Distributor_part_number: 541-100JCT-ND; Distributor_name: DIGIKEY; Package: 0402; Wattage: 1/16W; Tolerance: 5%; Library Ref: RESISTOR; PCB Footprint: RES0402_0-5
R246 R252 R688 = RESISTOR_Dup5: RES 0E 1/16W JUMPER 0402; Part_type: RESISTORS\FIXED; Mfr_part_number: CRCW04020000Z0ED; Mfr_name: VISHAY; Mistral Part No: 110010080019-R; Custom_Duty: 15%; Customs_HS_Code: 85332119; Voltage: NA; Project: PB_BUGBASE; Footprint Path: Y:\MIS_DATABASE\Library\ALTIUM_TOOL\PCB_FOOTPRINTS\Altium_Footprint_Lib.PcbLib; Library Path: Y:\MIS_DATABASE\Library\ALTIUM_TOOL\SCHEMATICS_PARTS\MS_DISCRETE_Library.schlib; Footprint Ref: RES0402_0-5; Library Ref: RESISTOR; Chkd/date: VASANTHA/201216; Crtd /date: MUDDU/190810; Datasheet: Y:\MIS_DATABASE\DATASHEETS\RESISTORS\CRCW0603.PDF; Temperature: -55癈+155癈; Weight: 0.65mg; Height: 0.40MM; Distributor_part_number: 541-0.0JCT-ND; Distributor_name: DIGIKEY; Package: 0402; Wattage: 1/16W; Tolerance: NA; MECHANICAL 3D STEP FILE: RES0402_0-5; PCB Footprint: RES0402_0-5
R248 R253 = RESISTOR_Dup6: RES 10K 1/16W 5% 0402; Mistral Part No: 110011060021-R; Mfr_name: YAGEO AMERICA; Mfr_part_number: RC0402JR-0710KL; Part_type: RESISTORS\FIXED; Project: HSE; Voltage: NA; Customs_HS_Code: 85332119; Custom_Duty: 15%; PCB Footprint: RES0402_0-5; Footprint Path: Y:\MIS_DATABASE\Library\ALTIUM_TOOL\PCB_FOOTPRINTS\Altium_Footprint_Lib.PcbLib; Library Path: Y:\MIS_DATABASE\Library\ALTIUM_TOOL\SCHEMATICS_PARTS\MS_DISCRETE_Library.schlib; Footprint Ref: RES0402_0-5; Library Ref: RESISTOR; Tolerance: 5%; Wattage: 1/16W; Package: 0402; Distributor_name: DIGIKEY; Distributor_part_number: 311-10KJRCT-ND; Height: 0.40MM; Weight: 0.65mg; Temperature: -55癈+155癈; Datasheet: Y:\MIS_DATABASE\DATASHEETS\RESISTORS\RCXXXXL-SER_MAR18.PDF; Crtd /date: MAZHAR/230805; Chkd/date: VASANTHA/061216; MECHANICAL 3D STEP FILE: RES0402_0-5
R254 = RESISTOR_Dup6: RES 0E 1/16W JUMPER 0402; Mistral Part No: 110010080019-R; Mfr_name: VISHAY; Mfr_part_number: CRCW04020000Z0ED; Part_type: RESISTORS\FIXED; Project: PB_BUGBASE; Tolerance: NA; Customs_HS_Code: 85332119; Custom_Duty: 15%; Voltage: NA; Wattage: 1/16W; Package: 0402; Distributor_name: DIGIKEY; Distributor_part_number: 541-0.0JCT-ND; Height: 0.40MM; Weight: 0.65mg; Temperature: -55癈+155癈; Datasheet: Y:\MIS_DATABASE\DATASHEETS\RESISTORS\CRCW0603.PDF; Crtd /date: MUDDU/190810; Chkd/date: VASANTHA/201216; MECHANICAL 3D STEP FILE: RES0402_0-5; Library Ref: RESISTOR; Footprint Ref: RES0402_0-5; Library Path: Y:\MIS_DATABASE\Library\ALTIUM_TOOL\SCHEMATICS_PARTS\MS_DISCRETE_Library.schlib; Footprint Path: Y:\MIS_DATABASE\Library\ALTIUM_TOOL\PCB_FOOTPRINTS\Altium_Footprint_Lib.PcbLib; PCB Footprint: RES0402_0-5
R262 = RESISTOR_Dup5: RES 1K 1/10W 1% 0402; Mistral Part No: 110009030411-R; Mfr_name: PANASONIC-ECG; Mfr_part_number: ERJ-2RKF1001X; Part_type: RESISTORS\FIXED; Project: VOCERA; Voltage: NA; Customs_HS_Code: 85332119; Custom_Duty: 15%; Footprint Path: Y:\MIS_DATABASE\Library\ALTIUM_TOOL\PCB_FOOTPRINTS\Altium_Footprint_Lib.PcbLib; Library Path: Y:\MIS_DATABASE\Library\ALTIUM_TOOL\SCHEMATICS_PARTS\MS_DISCRETE_Library.schlib; MECHANICAL 3D STEP FILE: RES0402_0-5; Footprint Ref: RES0402_0-5; Library Ref: RESISTOR; Tolerance: 1%; Wattage: 1/10W; Package: 0402; Distributor_name: DIGIKEY; Distributor_part_number: P1.00KLCT-ND; Height: 0.40MM; Weight: 0.8mg; Temperature: -55癈+155癈; Datasheet: Y:\MIS_DATABASE\DATASHEETS\RESISTORS\PAN-ERJSER_NOV17.PDF; Crtd /date: MAZHAR/150506; Chkd/date: VASANTHA/281216; PCB Footprint: RES0402_0-5
R268 R659 R660 = RESISTOR_Dup5: RES 0E 1/16W JUMPER 0402; Mistral Part No: 110010080019-R; Mfr_name: VISHAY; Mfr_part_number: CRCW04020000Z0ED; Part_type: RESISTORS\FIXED; Project: PB_BUGBASE; Tolerance: NA; Customs_HS_Code: 85332119; Custom_Duty: 15%; MECHANICAL 3D STEP FILE: RES0402_0-5; Voltage: NA; Wattage: 1/16W; Package: 0402; Distributor_name: DIGIKEY; Distributor_part_number: 541-0.0JCT-ND; Height: 0.40MM; Weight: 0.65mg; Temperature: -55癈+155癈; Datasheet: Y:\MIS_DATABASE\DATASHEETS\RESISTORS\CRCW0603.PDF; Crtd /date: MUDDU/190810; Chkd/date: VASANTHA/201216; Library Ref: RESISTOR; Footprint Ref: RES0402_0-5; Library Path: Y:\MIS_DATABASE\Library\ALTIUM_TOOL\SCHEMATICS_PARTS\MS_DISCRETE_Library.schlib; Footprint Path: Y:\MIS_DATABASE\Library\ALTIUM_TOOL\PCB_FOOTPRINTS\Altium_Footprint_Lib.PcbLib; PCB Footprint: RES0402_0-5
R652 R653 = RESISTOR_Dup6: RES 33E 1/10W 1% 0402; Part_type: RESISTORS\FIXED; Mfr_part_number: ERJ-2RKF33R0X; Mfr_name: PANASONIC-ECG; Mistral Part No: 110014110006-R; Custom_Duty: 15%; Customs_HS_Code: 85332119; Voltage: NA; Project: ZK BIOMETRIC; PCB Footprint: RES0402_0-5; MECHANICAL 3D STEP FILE: RES0402_0-5; Chkd/date: VASANTHA/061216; Crtd /date: JEBRAN/171114; Datasheet: Y:\MIS_DATABASE\DATASHEETS\RESISTORS\PAN-ERJSER_NOV17.PDF; Temperature: -55癈+155癈; Weight: 0.8mg; Height: 0.40MM; Distributor_part_number: P33.0LCT-ND; Distributor_name: DIGIKEY; Package: 0402; Wattage: 1/10W; Tolerance: 1%; Library Ref: RESISTOR; Footprint Ref: RES0402_0-5; Library Path: Y:\MIS_DATABASE\Library\ALTIUM_TOOL\SCHEMATICS_PARTS\MS_DISCRETE_Library.schlib; Footprint Path: Y:\MIS_DATABASE\Library\ALTIUM_TOOL\PCB_FOOTPRINTS\Altium_Footprint_Lib.PcbLib
R654 R655 = RESISTOR_Dup6: RES 33E 1/10W 1% 0402; Mistral Part No: 110014110006-R; Mfr_name: PANASONIC-ECG; Mfr_part_number: ERJ-2RKF33R0X; Part_type: RESISTORS\FIXED; Project: ZK BIOMETRIC; Voltage: NA; Customs_HS_Code: 85332119; Custom_Duty: 15%; PCB Footprint: RES0402_0-5; Footprint Path: Y:\MIS_DATABASE\Library\ALTIUM_TOOL\PCB_FOOTPRINTS\Altium_Footprint_Lib.PcbLib; Library Path: Y:\MIS_DATABASE\Library\ALTIUM_TOOL\SCHEMATICS_PARTS\MS_DISCRETE_Library.schlib; Footprint Ref: RES0402_0-5; Library Ref: RESISTOR; Tolerance: 1%; Wattage: 1/10W; Package: 0402; Distributor_name: DIGIKEY; Distributor_part_number: P33.0LCT-ND; Height: 0.40MM; Weight: 0.8mg; Temperature: -55癈+155癈; Datasheet: Y:\MIS_DATABASE\DATASHEETS\RESISTORS\PAN-ERJSER_NOV17.PDF; Crtd /date: JEBRAN/171114; Chkd/date: VASANTHA/061216; MECHANICAL 3D STEP FILE: RES0402_0-5
R656 R687 = RESISTOR_Dup4: RES 4.7K 1/16W 5% 0402; Mistral Part No: 110011060001-R; Mfr_name: YAGEO AMERICA; Mfr_part_number: RC0402JR-074K7L; Part_type: RESISTORS\FIXED; Project: TMDXCSK368; Voltage: NA; Customs_HS_Code: 85332119; Custom_Duty: 15%; PCB Footprint: RES0402_0-5; Footprint Path: Y:\MIS_DATABASE\Library\ALTIUM_TOOL\PCB_FOOTPRINTS\Altium_Footprint_Lib.PcbLib; Library Path: Y:\MIS_DATABASE\Library\ALTIUM_TOOL\SCHEMATICS_PARTS\MS_DISCRETE_Library.schlib; MECHANICAL 3D STEP FILE: RES0402_0-5; Footprint Ref: RES0402_0-5; Library Ref: RESISTOR; Tolerance: 5%; Wattage: 1/16W; Package: 0402; Distributor_name: DIGIKEY; Distributor_part_number: 311-4.7KJRCT-ND; Height: 0.40MM; Weight: 0.65mg; Temperature: -55癈+155癈; Datasheet: Y:\MIS_DATABASE\DATASHEETS\RESISTORS\RCXXXXL-SER_MAR18.PDF; Crtd /date: VASANTHA/130516; Chkd/date: VASANTHA/130516
R672 R686 = RESISTOR_Dup4: RES 4.7K 1/16W 5% 0402; Part_type: RESISTORS\FIXED; Mfr_part_number: RC0402JR-074K7L; Mfr_name: YAGEO AMERICA; Mistral Part No: 110011060001-R; Custom_Duty: 15%; Customs_HS_Code: 85332119; Voltage: NA; Project: TMDXCSK368; PCB Footprint: RES0402_0-5; Chkd/date: VASANTHA/130516; Crtd /date: VASANTHA/130516; Datasheet: Y:\MIS_DATABASE\DATASHEETS\RESISTORS\RCXXXXL-SER_MAR18.PDF; Temperature: -55癈+155癈; Weight: 0.65mg; Height: 0.40MM; Distributor_part_number: 311-4.7KJRCT-ND; Distributor_name: DIGIKEY; Package: 0402; Wattage: 1/16W; Tolerance: 5%; Library Ref: RESISTOR; Footprint Ref: RES0402_0-5; MECHANICAL 3D STEP FILE: RES0402_0-5; Library Path: Y:\MIS_DATABASE\Library\ALTIUM_TOOL\SCHEMATICS_PARTS\MS_DISCRETE_Library.schlib; Footprint Path: Y:\MIS_DATABASE\Library\ALTIUM_TOOL\PCB_FOOTPRINTS\Altium_Footprint_Lib.PcbLib
R681-R684 = RESISTOR: RES 49.9E 1/16W 1% 0402; Mistral Part No: 110009030846-R; Mfr_name: VISHAY; Mfr_part_number: CRCW040249R9FKEDC; Part_type: RESISTORS\FIXED; Project: RFSU_RFTJ_CARD; Voltage: NA; Customs_HS_Code: 85332119; Custom_Duty: 15%; PCB Footprint: RES0402_0-5; Footprint Ref: RES0402_0-5; Tolerance: 1%; Wattage: 1/16W; Package: 0402; Distributor_name: DIGIKEY; Distributor_part_number: 541-3967-1-ND; Library Ref: RESISTOR; Height: 0.35MM; Weight: 0.65mg; Temperature: -55癈+155癈; Datasheet: Y:\MIS_DATABASE\DATASHEETS\RESISTORS\CRCW_C-SER.PDF; Crtd /date: MANIRAJA/210519; Chkd/date: MANIRAJA/210519; MECHANICAL 3D STEP FILE: RES0402_0-5; Library Path: Y:\MIS_DATABASE\Library\ALTIUM_TOOL\SCHEMATICS_PARTS\MS_DISCRETE_Library.schlib; Footprint Path: Y:\MIS_DATABASE\Library\ALTIUM_TOOL\PCB_FOOTPRINTS\Altium_Footprint_Lib.PcbLib
TP102 = TESTPOINT: TESTPOINT CIR 40 SMD; Mfr_name: LOCAL; Mistral Part No: 130009030933; MECHANICAL 3D STEP FILE: NA; Project: RAINIER-3; PCB Footprint: TP40_SMD; RoHS: NA; Footprint Ref: TP40_SMD; Library Ref: TESTPOINT; Footprint Path: Y:\MIS_DATABASE\Library\ALTIUM_TOOL\PCB_FOOTPRINTS\Altium_Footprint_Lib.PcbLib; Library Path: Y:\MIS_DATABASE\Library\ALTIUM_TOOL\SCHEMATICS_PARTS\MS_DISCRETE_Library.schlib; Chkd/date: MAZHAR/190505; Crtd /date: MAZHAR/190505; Datasheet: NA; Temperature: NA; Weight: NA; Height: NA; Distributor_part_number: NA; Distributor_name: NA; Package: SMD; Wattage: NA; Voltage: NA; Tolerance: NA; Part_type: TESTPOINT; Mfr_part_number: TP40_SMD
U70 = CDCLVC1310RHBR_VQFN32: IC LOW JITTER,LOW POWER CLK BUFFER LEVEL TRANSLATOR VQFN32; Part_type: ICS\INTERFACE\LEVEL TRANSLATOR; Mfr_name: TEXAS INSTRUMENTS; Mistral Part No: 141017100003-R; Custom_Duty: 15%; Customs_HS_Code: 85423100; Wattage: NA; Project: TI_MAXIE_CPB; Library Ref: CDCLVC1310RHBR_VQFN32; MECHANICAL 3D STEP FILE: QFN32_19-68_200X200_1; Chkd/date: MANIRAJA/061017; Crtd /date: MANIRAJA/061017; Datasheet: Y:\MIS_DATABASE\DATASHEETS\ICS\INTERFACE\CDCLVC1310RHBR.PDF; Temperature: -40癈+85癈; Weight: 72.2mg; Height: 1.00MM; Distributor_part_number: 296-30105-1-ND; Distributor_name: DIGIKEY; Package: VQFN32; Voltage: NA; Tolerance: NA; Mfr_part_number: CDCLVC1310RHBR; PCB Footprint: QFN32_19-68_200X200_1
U71 = OSC_ASFLMB_SMD4: OSC 25MHz 15pF SMD; Mistral Part No: 130013110024-R; Mfr_name: ABRACON CORPORATION; Mfr_part_number: ASFLMB-25.000MHZ-LY-T; Part_type: OSCILLATORS; Project: DMP; Tolerance: NA; Customs_HS_Code: 85437099; Custom_Duty: 24%; Voltage: NA; Wattage: NA; Package: SMD; Distributor_name: DIGIKEY; Distributor_part_number: 535-11025-1-ND; Library Ref: OSC_ASFLMB_SMD4; Height: 0.90MM; Weight: NA; Temperature: -40癈+85癈; Datasheet: Y:\MIS_DATABASE\DATASHEETS\MISC\CRY_OSC\ASFLMB.PDF; Crtd /date: USMAN/231113; Chkd/date: USMAN/231113; PCB Footprint: OSC4_ASFLMB_200X130_SMD
U105 = CDCI6214RGET_VQFN24: IC PCIE GEN4 CLOCK GENERATOR WITH PROGRAMMABLE O/P AND EEPROM VQFN24; Part_type: ICS\DIGITAL\PERIPHERAL; Mfr_name: TEXAS INSTRUMENTS; Mistral Part No: 141017100002-R; Custom_Duty: 15%; Customs_HS_Code: 85423100; Wattage: NA; Project: TI_SVB_MAXWELL_DUT; PCB Footprint: QFN24_19-68_160X160_1; Library Ref: CDCI6214RGET_VQFN24; MECHANICAL 3D STEP FILE: QFN24_19-68_160X160_1; Chkd/date: MANIRAJA/051017; Crtd /date: MANIRAJA/051017; Datasheet: Y:\MIS_DATABASE\DATASHEETS\ICS\DIGITAL\PERIPHERAL\CDCI6214.PDF; Temperature: -40癈+85癈; Weight: NA; Height: 1.00MM; Distributor_part_number: NA; Distributor_name: NA; Package: VQFN24; Voltage: NA; Tolerance: NA; Mfr_part_number: CDCI6214RGET
Y4 = CRY: CRY 25.000MHz 18pF SMD; Mistral Part No: 130016020016-R; Mfr_name: CTS; Part_type: CRYSTAL; Project: PDI_MINIPCB; Tolerance: NA; Customs_HS_Code: 85439000; Custom_Duty: 24%; Voltage: NA; Wattage: NA; Package: SMD; Distributor_name: DIGIKEY; Distributor_part_number: CTX1175CT-ND; Height: 1.35MM; Weight: 50mg; Temperature: -40癈+85癈; Datasheet: Y:\MIS_DATABASE\DATASHEETS\MISC\CRY_OSC\445.PDF; Crtd /date: JEBRAN/090216; Chkd/date: VASANTHA/110316; Library Ref: CRY; MECHANICAL 3D STEP FILE: XTAL_ABM3_205X130_SMD_1-4; Footprint Ref: XTAL_ABM3_205X130_SMD_1-4; Library Path: Y:\MIS_DATABASE\Library\ALTIUM_TOOL\SCHEMATICS_PARTS\MS_DISCRETE_Library.schlib; Footprint Path: Y:\MIS_DATABASE\Library\ALTIUM_TOOL\PCB_FOOTPRINTS\Altium_Footprint_Lib.PcbLib; PCB Footprint: XTAL_ABM3_205X130_SMD_1-4